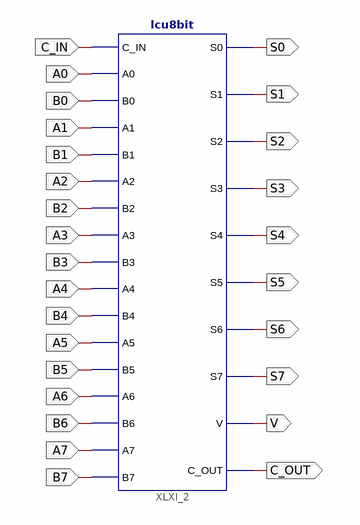
[diagram p0: schematic sheet 1]
// Xilinx ISE schematic dip_md3.sch (spartan3e) as structural Verilog: 1 symbols, 27 ports
module dip_md3 (
  input  C_IN,
  input  A0,
  input  B0,
  input  A1,
  input  B1,
  input  A2,
  input  B2,
  input  A3,
  input  B3,
  input  A4,
  input  B4,
  input  A5,
  input  B5,
  input  A6,
  input  B6,
  input  A7,
  input  B7,
  output C_OUT,
  output V,
  output S7,
  output S6,
  output S5,
  output S4,
  output S3,
  output S2,
  output S1,
  output S0
);

  lcu8bit XLXI_2 (
    .S4(S4), .S5(S5), .S6(S6), .S7(S7), .S0(S0), .S1(S1), .S2(S2), .S3(S3), .V(V), .C_OUT(C_OUT),
    .C_IN(C_IN), .A1(A1), .B1(B1), .A2(A2), .B2(B2), .A3(A3), .B3(B3), .A0(A0), .B0(B0), .A4(A4), .B4(B4),
    .A5(A5), .B5(B5), .A6(A6), .B6(B6), .A7(A7), .B7(B7));
endmodule
